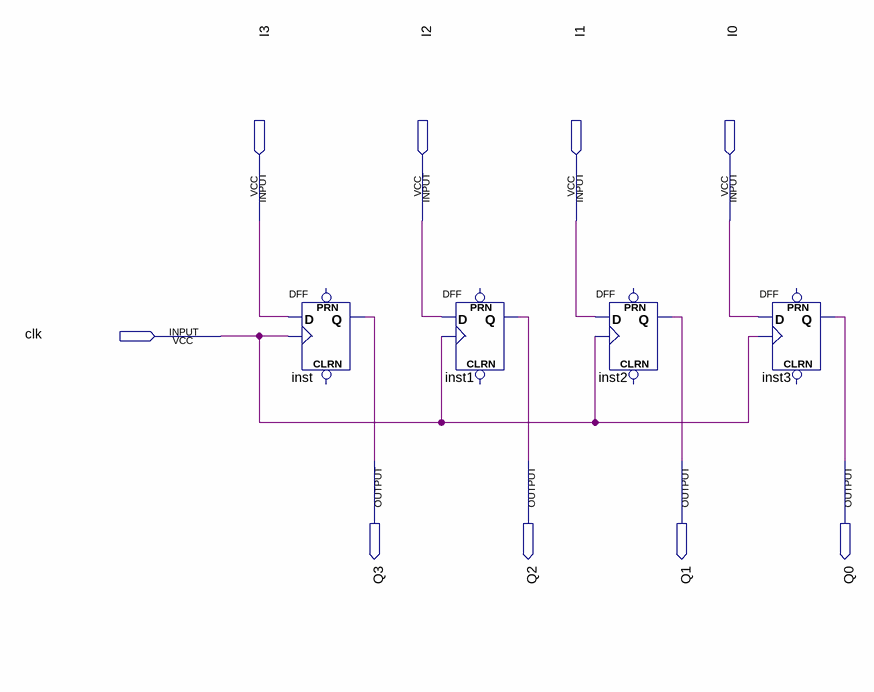
[diagram p0: schematic sheet]
// Quartus schematic Reg4bit.bdf as structural Verilog: 4 symbols, 9 pins
module Reg4bit (
  input  I3,
  input  I2,
  input  I1,
  input  I0,
  input  clk,
  output Q3,
  output Q2,
  output Q1,
  output Q0
);

  DFF inst (.CLK(clk), .D(I3), .Q(Q3));  // open: CLRN, PRN
  DFF inst1 (.CLK(clk), .D(I2), .Q(Q2));  // open: CLRN, PRN
  DFF inst2 (.CLK(clk), .D(I1), .Q(Q1));  // open: CLRN, PRN
  DFF inst3 (.CLK(clk), .D(I0), .Q(Q0));  // open: CLRN, PRN
endmodule
